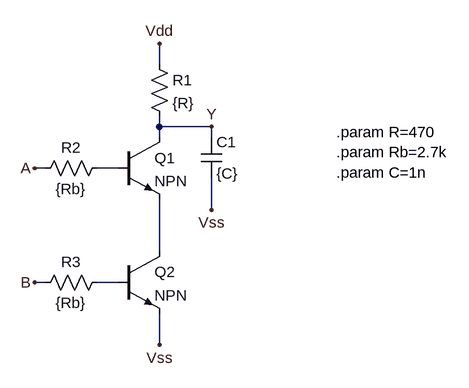
[diagram p0: schematic nand.asc]
nand.asc, the LTspice schematic file:
Version 4
SHEET 1 880 680
WIRE -240 -160 -240 -192
WIRE -240 -64 -240 -80
WIRE -160 -64 -240 -64
WIRE -240 -48 -240 -64
WIRE -160 -48 -160 -64
WIRE -416 0 -432 0
WIRE -304 0 -336 0
WIRE -160 64 -160 16
WIRE -240 128 -240 48
WIRE -416 176 -432 176
WIRE -304 176 -336 176
WIRE -240 272 -240 224
FLAG -160 -64 Y
FLAG -240 272 Vss
FLAG -240 -192 Vdd
FLAG -432 176 B
FLAG -432 0 A
FLAG -160 64 Vss
SYMBOL npn -304 -48 R0
SYMATTR InstName Q1
SYMBOL npn -304 128 R0
SYMATTR InstName Q2
SYMBOL res -256 -176 R0
SYMATTR InstName R1
SYMATTR Value {R}
SYMBOL res -320 -16 R90
WINDOW 0 0 56 VBottom 2
WINDOW 3 32 56 VTop 2
SYMATTR InstName R2
SYMATTR Value {Rb}
SYMBOL res -320 160 R90
WINDOW 0 0 56 VBottom 2
WINDOW 3 32 56 VTop 2
SYMATTR InstName R3
SYMATTR Value {Rb}
SYMBOL cap -176 -48 R0
SYMATTR InstName C1
SYMATTR Value {C}
TEXT 32 -56 Left 2 !.param R=470\n.param Rb=2.7k\n.param C=1n

The netlist it stands for:
* nand.asc
Q1 Y N001 N002 0 NPN
Q2 N002 N003 Vss 0 NPN
R1 Vdd Y {R}
R2 N001 A {Rb}
R3 N003 B {Rb}
C1 Y Vss {C}
.model NPN NPN
.model PNP PNP
.lib standard.bjt
.param R=470
.param Rb=2.7k
.param C=1n
.backanno
.end